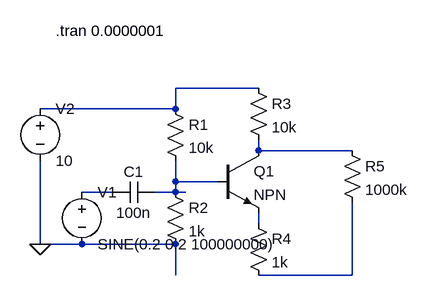
[diagram p0: schematic CommonEmitterAmplifier.asc]
CommonEmitterAmplifier.asc, the LTspice schematic file:
Version 4
SHEET 1 880 680
WIRE 560 128 432 128
WIRE 432 160 432 128
WIRE 432 160 224 160
WIRE 560 224 560 208
WIRE 704 224 560 224
WIRE 432 272 432 240
WIRE 496 272 432 272
WIRE 336 288 288 288
WIRE 432 288 432 272
WIRE 432 288 400 288
WIRE 448 288 432 288
WIRE 560 336 560 320
WIRE 224 368 224 240
WIRE 288 368 224 368
WIRE 432 368 288 368
WIRE 432 416 432 368
WIRE 704 416 704 304
WIRE 704 416 560 416
FLAG 224 368 0
SYMBOL voltage 288 272 R0
SYMATTR InstName V1
SYMATTR Value SINE(0.2 0.2 100000000)
SYMBOL voltage 224 144 R0
SYMATTR InstName V2
SYMATTR Value 10
SYMBOL npn 496 224 R0
SYMATTR InstName Q1
SYMBOL cap 400 272 R90
WINDOW 0 0 32 VBottom 2
WINDOW 3 32 32 VTop 2
SYMATTR InstName C1
SYMATTR Value 100n
SYMBOL res 416 144 R0
SYMATTR InstName R1
SYMATTR Value 10k
SYMBOL res 416 272 R0
SYMATTR InstName R2
SYMATTR Value 1k
SYMBOL res 544 112 R0
SYMATTR InstName R3
SYMATTR Value 10k
SYMBOL res 544 320 R0
SYMATTR InstName R4
SYMATTR Value 1k
SYMBOL res 688 208 R0
SYMATTR InstName R5
SYMATTR Value 1000k
TEXT 248 40 Left 2 !.tran 0.0000001

The netlist it stands for:
* CommonEmitterAmplifier.asc
V1 N004 0 SINE(0.2 0.2 100000000)
V2 N001 0 10
Q1 N002 N003 N005 0 NPN
C1 N003 N004 100n
R1 N001 N003 10k
R2 N003 0 1k
R3 N001 N002 10k
R4 N005 N006 1k
R5 N002 N006 1000k
.model NPN NPN
.model PNP PNP
.lib standard.bjt
.tran 0.0000001
.backanno
.end